# Altium schematic sheet Current Sense Schematic.SchDoc
size A
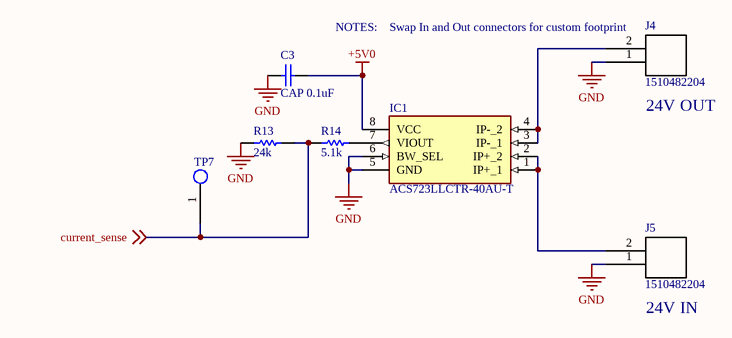
[diagram p0: Current Sense Schematic.SchDoc]

## Parts
C3  CAP 0.1uF  [CAPC0805(2012)75_L]
IC1  ACS723LLCTR-40AU-T  [SOT127P600X175-8N]
J4  1510482204  [1510482204]
J5  1510482204  [1510482204]
R13  24k  [RESC2013X70X40LL20T20]
R14  5.1k  [RESC2013X70X40LL20T20]
TP7  Test Point  [Test Point Through-hole]  (value not drawn)

## Nets
+5V0: C3.2 IC1.8(VCC)
GND: C3.1 IC1.5(GND) IC1.6(BW_SEL) J4.1 J5.1 R13.2
current_sense: R13.1 R14.2 TP7.1 ; off-sheet current_sense
NetIC1_1: IC1.1(IP+_1) IC1.2(IP+_2) J5.2
NetIC1_3: IC1.3(IP-_1) IC1.4(IP-_2) J4.2
NetIC1_7: IC1.7(VIOUT) R14.1

## Notes on the sheet
- NOTES:
- (near J4) Swap In and Out connectors for custom footprint
- (near J4) 24V OUT
- (near J5) 24V IN
- Title
- Size:
- Date:
- A
- Number:
- Time:
- Revision:
- Sheet
- of
- File:

## Library data of the parts
C3 = CMP-1036-00339-1: CAP 2.7pF 50V ±0.1pF 0805 (2012 Metric) Thickness 0.75mm SMD; Case-EIA: 0805; Case-Metric: 2012; Tolerance: Â±0.1pF; Rated Voltage: 50 V; Value: 2.7pF; Max Thickness: 0.75 mm; Technology: SMT
IC1 = ACS723LLCTR-40AU-T: Integrated Circuit; Manufacturer_Name: Allegro Microsystems; Datasheet Link: http://www.allegromicro.com/~/media/Files/Datasheets/ACS723-Datasheet.ashx; Height: 1.75mm; Manufacturer_Part_Number: ACS723LLCTR-40AU-T
J4 J5 = 1510482204: Molex 6.5MM 2 pin connector, used for power connections. P/N 1510482204 and similar models.
R13 R14 = CMP-2001-04440-2: RES SMD 150K OHM 1% 1/8W 0805; Manufacturer: Panasonic; Part Number: ERJ-6ENF1503V; Datasheet: http://industrial.panasonic.com/cdbs/www-data/pdf/RDA0000/AOA0000C86.pdf